# EAGLE design learn to solder (EAGLE 6.4)
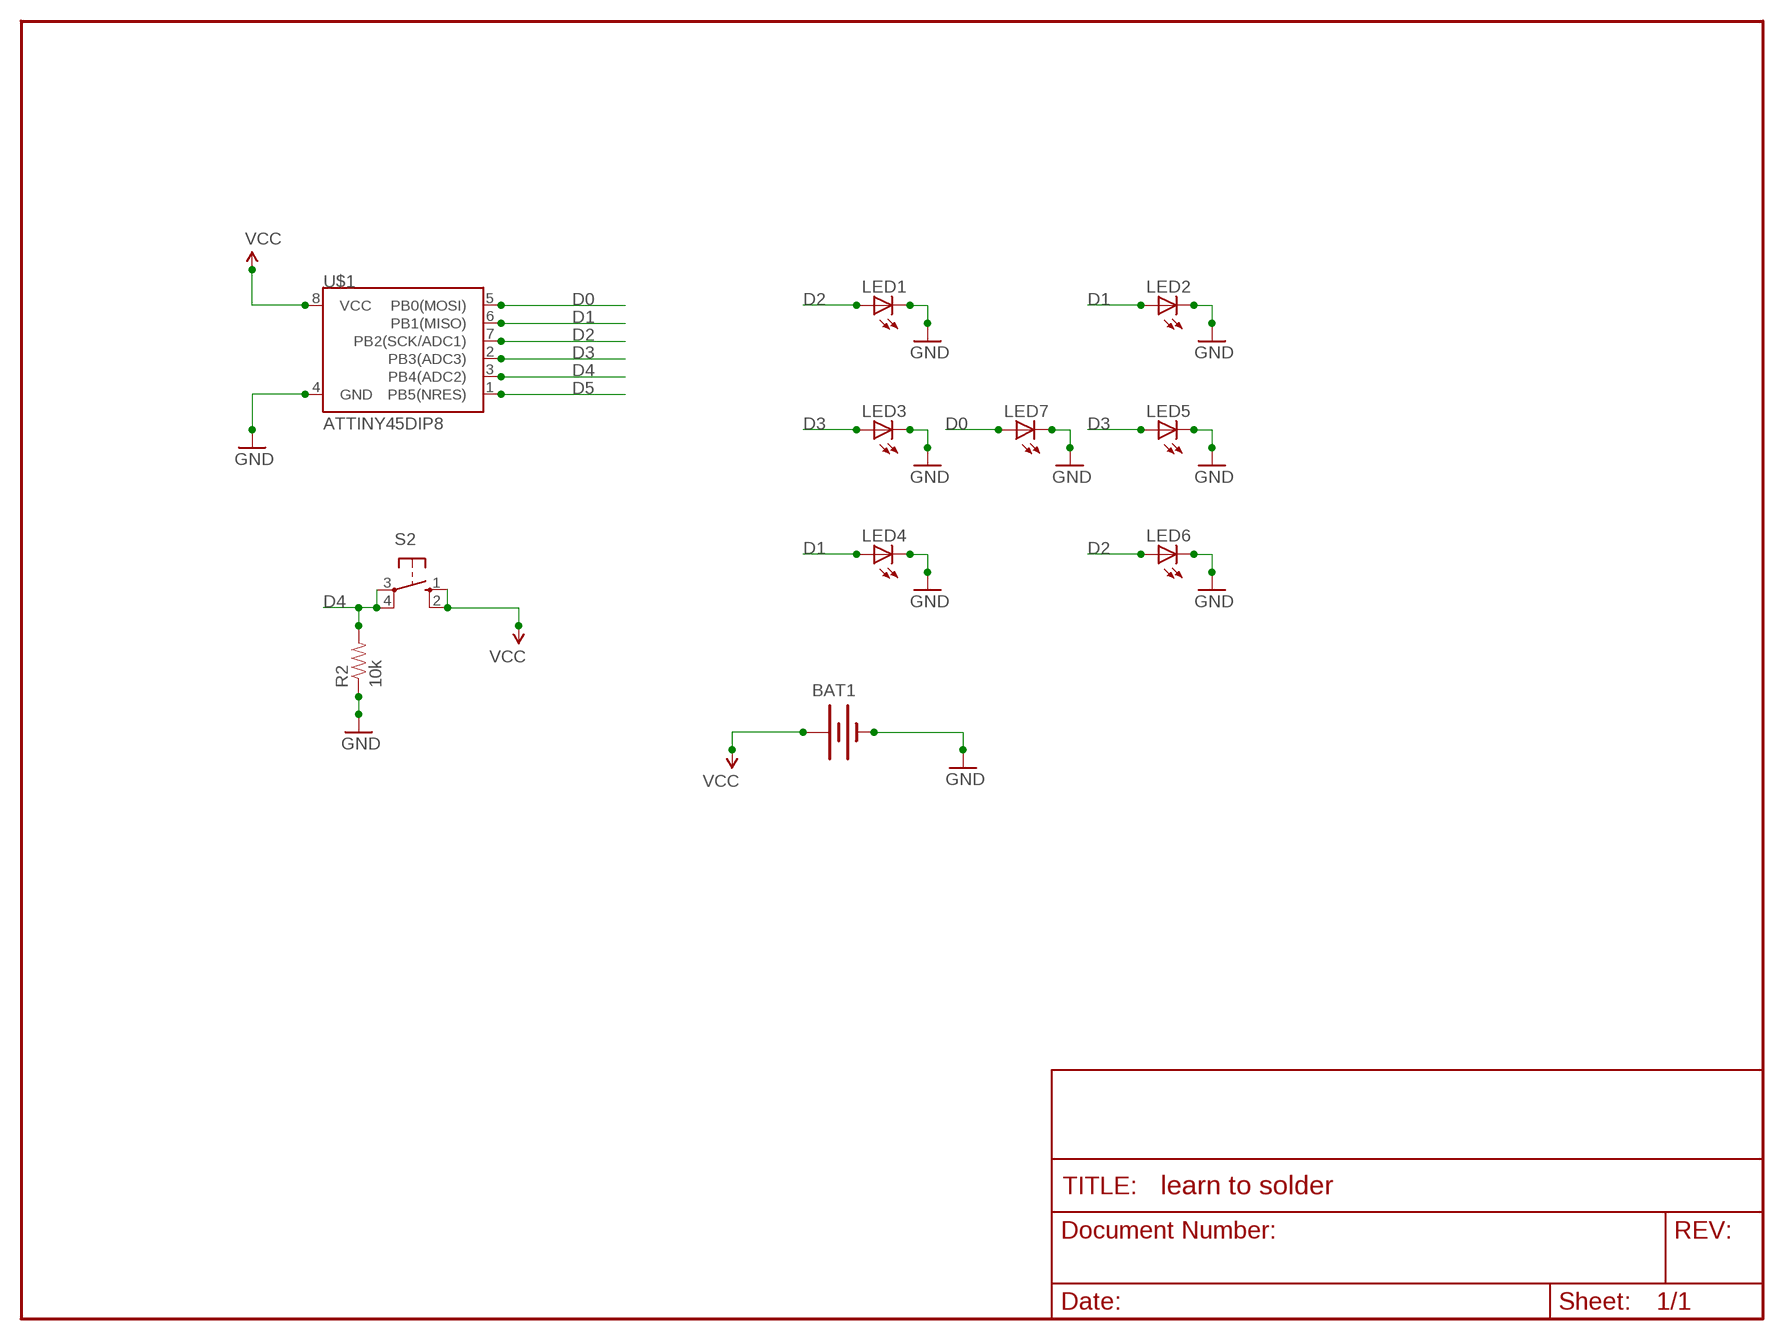
[diagram p0: schematic, sheet 1]

## Parts
BAT1  BATTERY20PTH  [BATTCOM_20MM_PTH]
LED1  LED5MM  [LED5MM]
LED2  LED5MM  [LED5MM]
LED3  LED5MM  [LED5MM]
LED4  LED5MM  [LED5MM]
LED5  LED5MM  [LED5MM]
LED6  LED5MM  [LED5MM]
LED7  LED5MM  [LED5MM]
R2  10k  RESISTORAXIAL-0.3  [AXIAL-0.3]
S2  40-XX  [B3F-40XX]
U$1  ATTINY45DIP8  [DIP08]

## Nets
D0: LED7.A U$1.5(PB0(MOSI))
D1: LED2.A LED4.A U$1.6(PB1(MISO))
D2: LED1.A LED6.A U$1.7(PB2(SCK/ADC1))
D3: LED3.A LED5.A U$1.2(PB3(ADC3))
D4: R2.P$2 S2.3(P) S2.4(P1) U$1.3(PB4(ADC2))
D5: U$1.1(PB5(NRES))
GND: BAT1.2(-) LED1.K(C) LED2.K(C) LED3.K(C) LED4.K(C) LED5.K(C) LED6.K(C) LED7.K(C) R2.P$1 U$1.4(GND)
VCC: BAT1.1(+) S2.1(S) S2.2(S1) U$1.8(VCC)

## Library data of the parts
BAT1 = SparkFun:BATTERY: Battery Holders Various common sizes : AA, AAA, 20mm coin cell and 12mm coin cell.
LED1-LED7 = SparkFun:LED: LEDs Standard schematic elements and footprints for 5mm, 3mm, 1206, and 0603 sized LEDs. 5mm - Spark Fun Electronics SKU : COM-00529 (and others)
R2 = SparkFun:RESISTOR: Resistor Basic schematic elements and footprints for 0603, 1206, and PTH resistors.
S2 = switch-omron:40-XX: OMRON SWITCH; MF: OMRON COMPONENTS USA; MPN: B3F-4000; OC_FARNELL: 176434; OC_NEWARK: 36K3105
U$1 = SparkFun:ATTINY45: Atmel ATTiny45

## Board
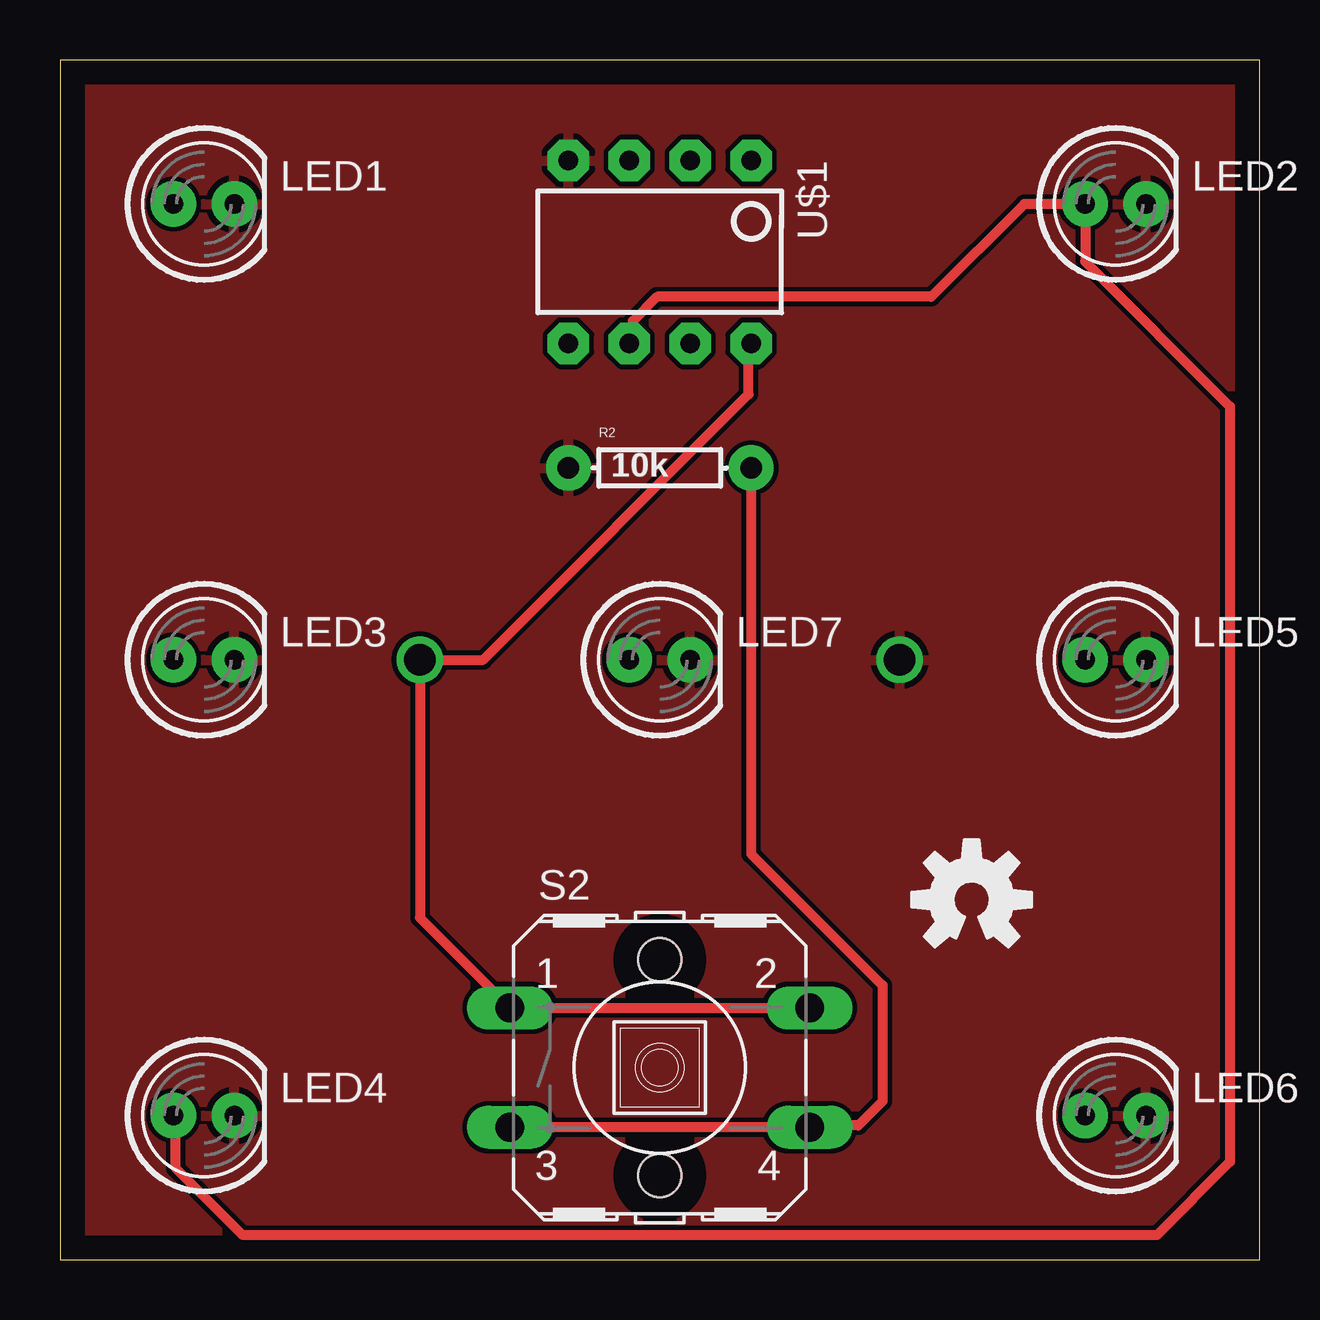
[diagram p1: board, top side]
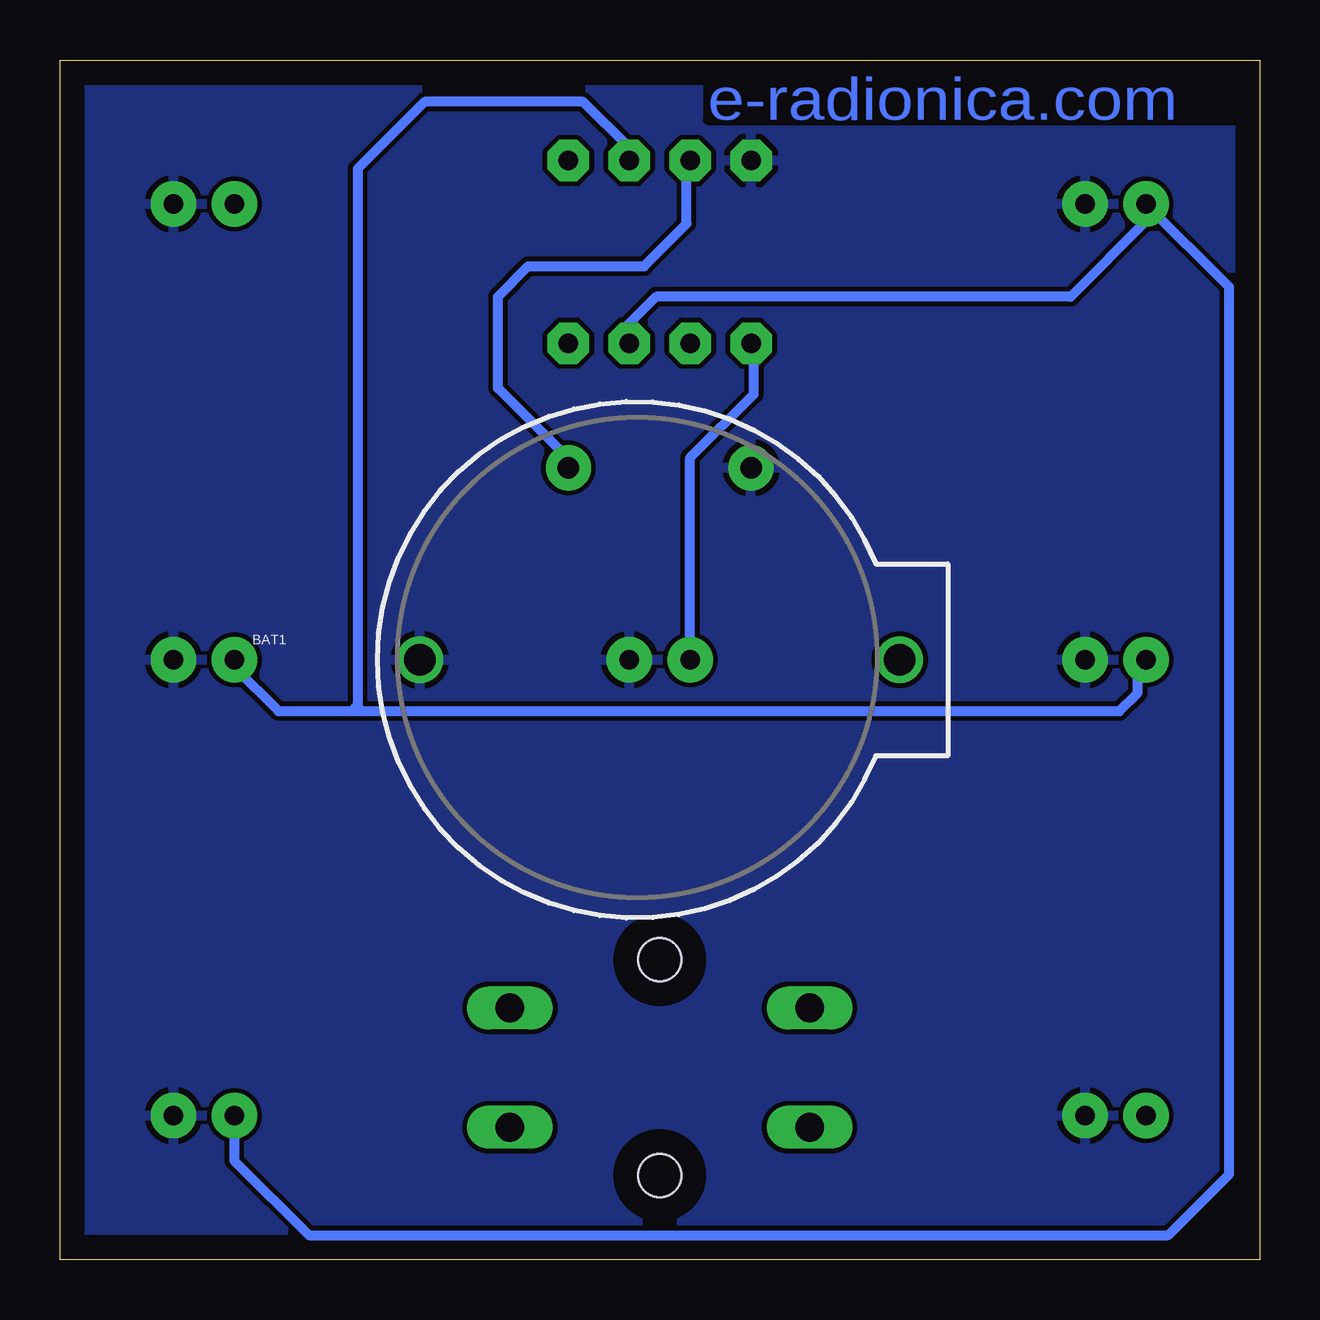
[diagram p2: board, bottom side, seen from below]

Size 50 x 50 mm. Coordinates in mm from the lower left corner, seen from the top.
Outline: 0,0 50,0 50,50 0,50 0,0
Copper layers (1*16): Top 0.035mm / dielectric 1.5mm / Bottom 0.035mm
Design rules "default": minimum track width 10mil, minimum drill 24mil, track to track 8mil, track to pad 8mil, pad to pad 8mil, via to via 8mil, smd to smd 8mil, copper to edge 40mil, drill to drill 8mil, minimum pad ring 10mil, minimum via ring 8mil, stop-mask expansion 4mil, vias tented up to drill 0mil, thermal gap 10mil

### Footprints (pad centres in the part's own frame; a part is rotated, then mirrored left to right if it is on the bottom)
BATTCOM_20MM_PTH = drill 1.3: 1 20,0; 2 0,0
LED5MM = drill 0.813 pad 1.88: A -1.27,0; K 1.27,0
AXIAL-0.3 = drill 0.9 pad 1.88: P$1 -3.81,0; P$2 3.81,0
B3F-40XX = drill 1.194 long: 1 -6.248,2.489; 2 6.248,2.489; 3 -6.248,-2.489; 4 6.248,-2.489 | hole 1.803: 0,-4.496; 0,4.496
DIP08 = drill 0.813 pad 1.727 octagon: 1 -3.81,-3.81; 2 -1.27,-3.81; 3 1.27,-3.81; 4 3.81,-3.81; 5 3.81,3.81; 6 1.27,3.81; 7 -1.27,3.81; 8 -3.81,3.81

### Placement (x,y rotation side)
BAT1  35,25 0 bottom
LED1  6,44 0 top
LED2  44,44 0 top
LED3  6,25 0 top
LED4  6,6 0 top
LED5  44,25 0 top
LED6  44,6 0 top
LED7  25,25 0 top
R2  25,33 0 top
S2  25,8 0 top
U$1  25,42 180 top
U$2  [UTICNICA6MM]  41,13 0 top
U$3  [OSHW-LOGO-M]  38,15 0 top
U$4  [MADE-IN-CROATIA]  1,1 0 top

### Tracks (layer width: path | path; a pad name or v marks a point on that pad's centre or on a via)
D0
  Bottom 0.406: LED7.A 23.73,33.42 21.08,36.07 21.08,38.08 U$1.5
D1
  Top 0.406: U$1.6 23.88,38.34 23.88,39.12 24.89,40.13 36.32,40.13 40.19,44 LED2.A 42.73,41.6 48.77,35.56 48.77,4.06 45.72,1.02 7.62,1.02 4.83,3.81 4.83,5.9 LED4.A
D2
  Bottom 0.406: U$1.7 26.67,38.59 26.67,38.61 25.15,40.13 7.87,40.13 4.73,43.28 LED1.A 1.27,40.54 1.27,3.56 3.81,1.02 39.62,1.02 42.73,4.12 LED6.A
D3
  Bottom 0.406: LED5.A 42.73,24.7 40.89,22.86 37.85,22.86 | 37.85,22.86 5.84,22.86 5.08,23.62 5.08,24.65 LED3.A | U$1.2 26.27,46.34 28.19,48.26 34.8,48.26 37.59,45.47 37.59,23.11 37.85,22.86
D4
  Top 0.406: S2.3 S2.4 31.33,5.59 33.27,5.59 34.29,6.6 34.29,11.43 28.81,16.91 R2.P$2 | S2.3 18.62,5.51 18.29,5.84 18.42,5.84 S2.3
  Bottom 0.406: R2.P$2 28.81,33.38 31.75,36.32 31.75,40.13 30.48,41.4 25.65,41.4 23.88,43.18 23.88,45.66 U$1.3
GND
  pour Bottom: 0,0 0,50 50,50 50,0
  pour Top: 0,0 0,50 50,50 50,0
VCC
  Top 0.406: S2.2 S2.1 15,14.24 BAT1.1 17.63,25 28.7,36.07 28.7,38.08 U$1.8

### Text on the board
Bottom: e-radionica.com
bStop: e-radionca.com
200bmp: LED1 | LED2 | - | - | IC1 | R1 | Kockica od / LEDa | LED3 | LED4 | LED5 | - | - | - | S1 | LED6 | LED7 | - | -